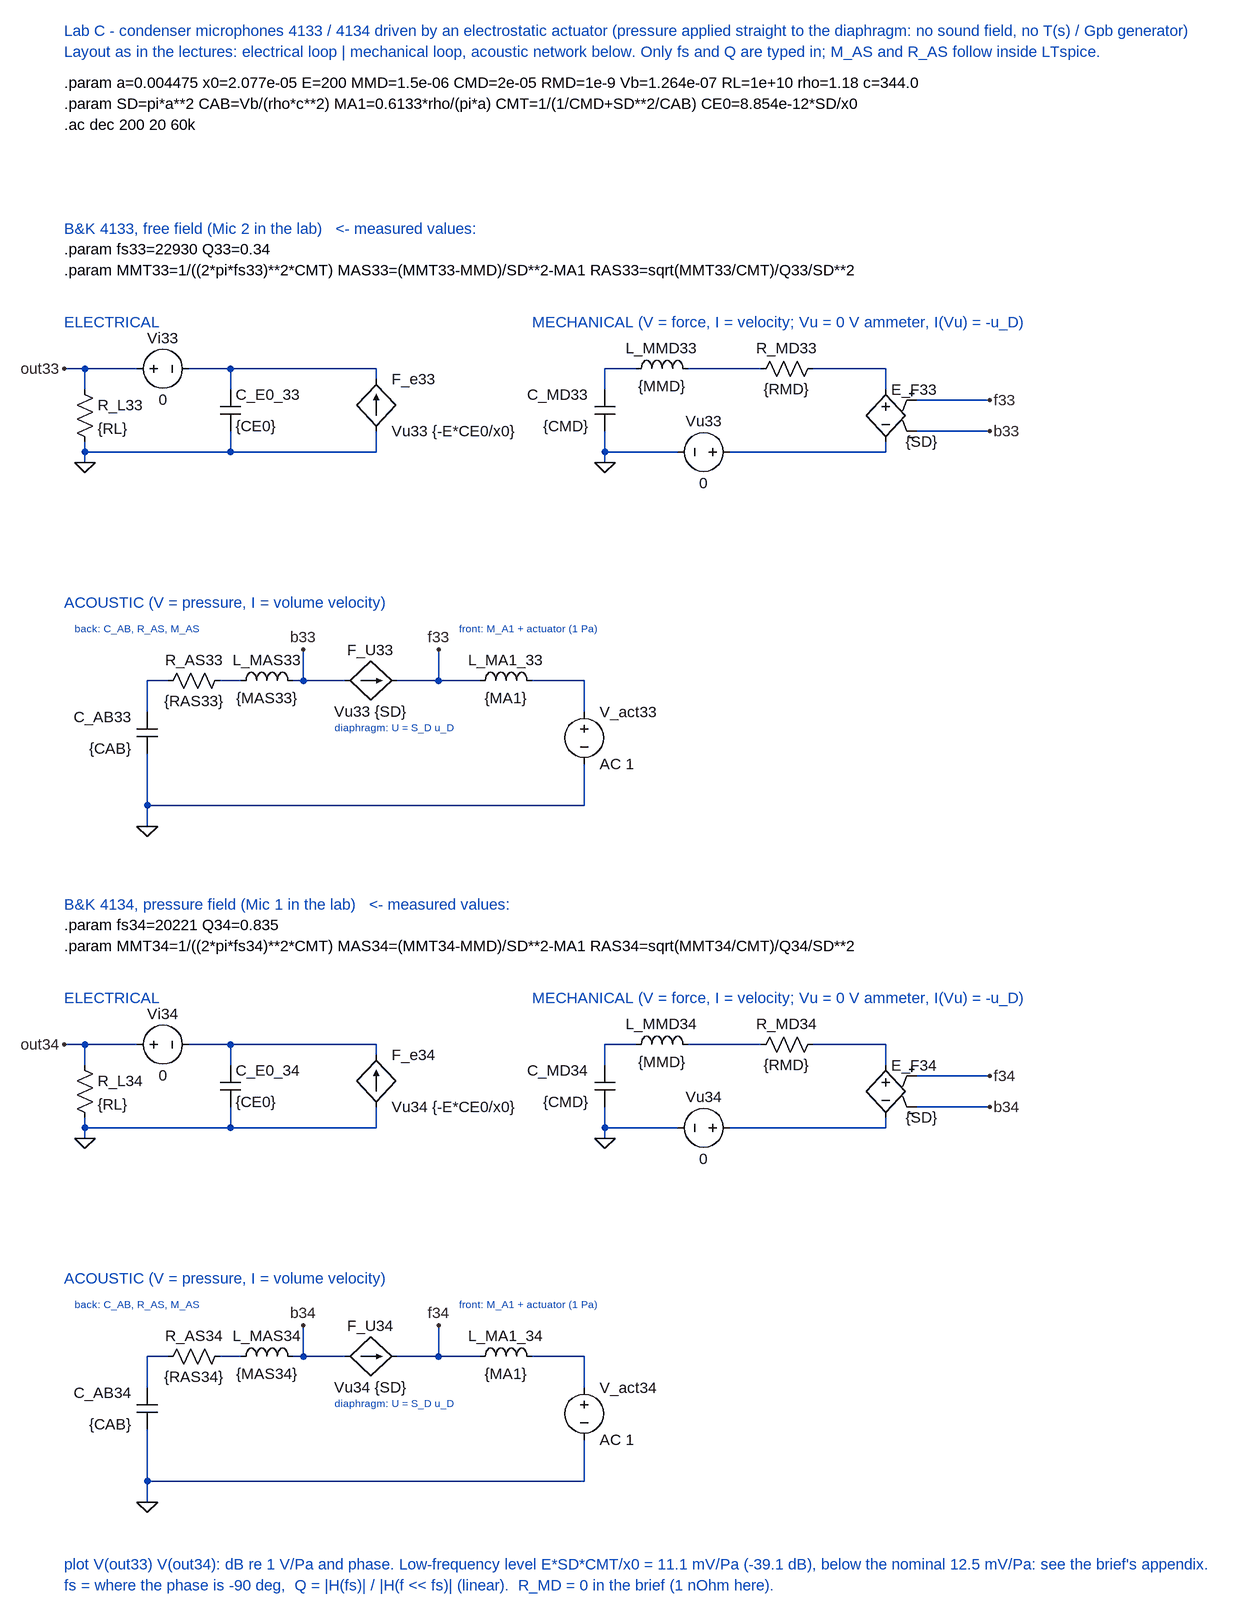
[diagram p0: schematic LabC_CondenserMics.asc]
LabC_CondenserMics.asc, the LTspice schematic file:
Version 4.1
SHEET 1 2400 2000
TEXT -128 -440 Left 2 ;Lab C - condenser microphones 4133 / 4134 driven by an electrostatic actuator (pressure applied straight to the diaphragm: no sound field, no T(s) / Gpb generator)
TEXT -128 -408 Left 2 ;Layout as in the lectures: electrical loop | mechanical loop, acoustic network below. Only fs and Q are typed in; M_AS and R_AS follow inside LTspice.
TEXT -128 -360 Left 2 !.param a=0.004475 x0=2.077e-05 E=200 MMD=1.5e-06 CMD=2e-05 RMD=1e-9 Vb=1.264e-07 RL=1e+10 rho=1.18 c=344.0
TEXT -128 -328 Left 2 !.param SD=pi*a**2 CAB=Vb/(rho*c**2) MA1=0.6133*rho/(pi*a) CMT=1/(1/CMD+SD**2/CAB) CE0=8.854e-12*SD/x0
TEXT -128 -296 Left 2 !.ac dec 200 20 60k
TEXT -128 -136 Left 2 ;B&K 4133, free field (Mic 2 in the lab)   <- measured values:
TEXT -128 -104 Left 2 !.param fs33=22930 Q33=0.34
TEXT -128 -72 Left 2 !.param MMT33=1/((2*pi*fs33)**2*CMT) MAS33=(MMT33-MMD)/SD**2-MA1 RAS33=sqrt(MMT33/CMT)/Q33/SD**2
TEXT -128 8 Left 2 ;ELECTRICAL
WIRE -96 80 -128 80
WIRE -16 80 -96 80
WIRE 128 80 64 80
WIRE 352 80 128 80
WIRE 352 96 352 80
WIRE -96 112 -96 80
WIRE 128 112 128 80
WIRE -96 208 -96 192
WIRE 128 208 128 176
WIRE 128 208 -96 208
WIRE 352 208 352 176
WIRE 352 208 128 208
WIRE -96 224 -96 208
FLAG -96 224 0
FLAG -128 80 out33
SYMBOL res -112 96 R0
SYMATTR InstName R_L33
SYMATTR Value {RL}
SYMBOL voltage -32 80 R270
WINDOW 0 32 56 VTop 2
WINDOW 3 -32 56 VBottom 2
SYMATTR InstName Vi33
SYMATTR Value 0
SYMBOL cap 112 112 R0
SYMATTR InstName C_E0_33
SYMATTR Value {CE0}
SYMBOL f 352 176 M180
WINDOW 0 24 80 Left 2
WINDOW 3 24 0 Left 2
SYMATTR InstName F_e33
SYMATTR Value Vu33 {-E*CE0/x0}
TEXT 592 8 Left 2 ;MECHANICAL (V = force, I = velocity; Vu = 0 V ammeter, I(Vu) = -u_D)
WIRE 752 80 704 80
WIRE 944 80 832 80
WIRE 1136 80 1024 80
WIRE 1136 112 1136 80
WIRE 704 112 704 80
WIRE 704 208 704 176
WIRE 816 208 704 208
WIRE 1136 208 1136 192
WIRE 1136 208 896 208
WIRE 704 224 704 208
WIRE 1184 128 1296 128
WIRE 1184 176 1296 176
FLAG 704 224 0
FLAG 1296 128 f33
FLAG 1296 176 b33
SYMBOL cap 688 112 R0
WINDOW 0 -8 8 Right 2
WINDOW 3 -8 56 Right 2
SYMATTR InstName C_MD33
SYMATTR Value {CMD}
SYMBOL ind 736 96 R270
WINDOW 0 32 56 VTop 2
WINDOW 3 5 56 VBottom 2
SYMATTR InstName L_MMD33
SYMATTR Value {MMD}
SYMATTR SpiceLine Rser=0
SYMBOL res 1040 64 R90
WINDOW 0 0 56 VBottom 2
WINDOW 3 32 56 VTop 2
SYMATTR InstName R_MD33
SYMATTR Value {RMD}
SYMBOL e 1136 96 M0
WINDOW 0 -80 16 Left 2
WINDOW 3 -80 96 Left 2
SYMATTR InstName E_F33
SYMATTR Value {SD}
SYMBOL voltage 912 208 R90
WINDOW 0 -32 56 VBottom 2
WINDOW 3 32 56 VTop 2
SYMATTR InstName Vu33
SYMATTR Value 0
TEXT -128 440 Left 2 ;ACOUSTIC (V = pressure, I = volume velocity)
TEXT -112 480 Left 1 ;back: C_AB, R_AS, M_AS
TEXT 288 632 Left 1 ;diaphragm: U = S_D u_D
TEXT 480 480 Left 1 ;front: M_A1 + actuator (1 Pa)
WIRE 32 560 0 560
WIRE 144 560 112 560
WIRE 288 560 224 560
WIRE 240 560 240 512
WIRE 304 560 288 560
WIRE 448 560 448 512
WIRE 400 560 384 560
WIRE 512 560 400 560
WIRE 672 560 592 560
WIRE 672 608 672 560
WIRE 0 608 0 560
WIRE 0 752 0 672
WIRE 672 752 672 688
WIRE 672 752 0 752
WIRE 0 784 0 752
FLAG 0 784 0
FLAG 448 512 f33
FLAG 240 512 b33
SYMBOL cap -16 608 R0
WINDOW 0 -8 8 Right 2
WINDOW 3 -8 56 Right 2
SYMATTR InstName C_AB33
SYMATTR Value {CAB}
SYMATTR SpiceLine Rpar=1e15
SYMBOL res 128 544 R90
WINDOW 0 0 56 VBottom 2
WINDOW 3 32 56 VTop 2
SYMATTR InstName R_AS33
SYMATTR Value {RAS33}
SYMBOL ind 128 576 R270
WINDOW 0 32 56 VTop 2
WINDOW 3 5 56 VBottom 2
SYMATTR InstName L_MAS33
SYMATTR Value {MAS33}
SYMATTR SpiceLine Rser=0
SYMBOL f 304 560 R270
WINDOW 0 32 40 VTop 2
WINDOW 3 -32 40 VBottom 2
SYMATTR InstName F_U33
SYMATTR Value Vu33 {SD}
SYMBOL ind 496 576 R270
WINDOW 0 32 56 VTop 2
WINDOW 3 5 56 VBottom 2
SYMATTR InstName L_MA1_33
SYMATTR Value {MA1}
SYMATTR SpiceLine Rser=0
SYMBOL voltage 672 592 R0
SYMATTR InstName V_act33
SYMATTR Value AC 1
TEXT -128 904 Left 2 ;B&K 4134, pressure field (Mic 1 in the lab)   <- measured values:
TEXT -128 936 Left 2 !.param fs34=20221 Q34=0.835
TEXT -128 968 Left 2 !.param MMT34=1/((2*pi*fs34)**2*CMT) MAS34=(MMT34-MMD)/SD**2-MA1 RAS34=sqrt(MMT34/CMT)/Q34/SD**2
TEXT -128 1048 Left 2 ;ELECTRICAL
WIRE -96 1120 -128 1120
WIRE -16 1120 -96 1120
WIRE 128 1120 64 1120
WIRE 352 1120 128 1120
WIRE 352 1136 352 1120
WIRE -96 1152 -96 1120
WIRE 128 1152 128 1120
WIRE -96 1248 -96 1232
WIRE 128 1248 128 1216
WIRE 128 1248 -96 1248
WIRE 352 1248 352 1216
WIRE 352 1248 128 1248
WIRE -96 1264 -96 1248
FLAG -96 1264 0
FLAG -128 1120 out34
SYMBOL res -112 1136 R0
SYMATTR InstName R_L34
SYMATTR Value {RL}
SYMBOL voltage -32 1120 R270
WINDOW 0 32 56 VTop 2
WINDOW 3 -32 56 VBottom 2
SYMATTR InstName Vi34
SYMATTR Value 0
SYMBOL cap 112 1152 R0
SYMATTR InstName C_E0_34
SYMATTR Value {CE0}
SYMBOL f 352 1216 M180
WINDOW 0 24 80 Left 2
WINDOW 3 24 0 Left 2
SYMATTR InstName F_e34
SYMATTR Value Vu34 {-E*CE0/x0}
TEXT 592 1048 Left 2 ;MECHANICAL (V = force, I = velocity; Vu = 0 V ammeter, I(Vu) = -u_D)
WIRE 752 1120 704 1120
WIRE 944 1120 832 1120
WIRE 1136 1120 1024 1120
WIRE 1136 1152 1136 1120
WIRE 704 1152 704 1120
WIRE 704 1248 704 1216
WIRE 816 1248 704 1248
WIRE 1136 1248 1136 1232
WIRE 1136 1248 896 1248
WIRE 704 1264 704 1248
WIRE 1184 1168 1296 1168
WIRE 1184 1216 1296 1216
FLAG 704 1264 0
FLAG 1296 1168 f34
FLAG 1296 1216 b34
SYMBOL cap 688 1152 R0
WINDOW 0 -8 8 Right 2
WINDOW 3 -8 56 Right 2
SYMATTR InstName C_MD34
SYMATTR Value {CMD}
SYMBOL ind 736 1136 R270
WINDOW 0 32 56 VTop 2
WINDOW 3 5 56 VBottom 2
SYMATTR InstName L_MMD34
SYMATTR Value {MMD}
SYMATTR SpiceLine Rser=0
SYMBOL res 1040 1104 R90
WINDOW 0 0 56 VBottom 2
WINDOW 3 32 56 VTop 2
SYMATTR InstName R_MD34
SYMATTR Value {RMD}
SYMBOL e 1136 1136 M0
WINDOW 0 -80 16 Left 2
WINDOW 3 -80 96 Left 2
SYMATTR InstName E_F34
SYMATTR Value {SD}
SYMBOL voltage 912 1248 R90
WINDOW 0 -32 56 VBottom 2
WINDOW 3 32 56 VTop 2
SYMATTR InstName Vu34
SYMATTR Value 0
TEXT -128 1480 Left 2 ;ACOUSTIC (V = pressure, I = volume velocity)
TEXT -112 1520 Left 1 ;back: C_AB, R_AS, M_AS
TEXT 288 1672 Left 1 ;diaphragm: U = S_D u_D
TEXT 480 1520 Left 1 ;front: M_A1 + actuator (1 Pa)
WIRE 32 1600 0 1600
WIRE 144 1600 112 1600
WIRE 288 1600 224 1600
WIRE 240 1600 240 1552
WIRE 304 1600 288 1600
WIRE 448 1600 448 1552
WIRE 400 1600 384 1600
WIRE 512 1600 400 1600
WIRE 672 1600 592 1600
WIRE 672 1648 672 1600
WIRE 0 1648 0 1600
WIRE 0 1792 0 1712
WIRE 672 1792 672 1728
WIRE 672 1792 0 1792
WIRE 0 1824 0 1792
FLAG 0 1824 0
FLAG 448 1552 f34
FLAG 240 1552 b34
SYMBOL cap -16 1648 R0
WINDOW 0 -8 8 Right 2
WINDOW 3 -8 56 Right 2
SYMATTR InstName C_AB34
SYMATTR Value {CAB}
SYMATTR SpiceLine Rpar=1e15
SYMBOL res 128 1584 R90
WINDOW 0 0 56 VBottom 2
WINDOW 3 32 56 VTop 2
SYMATTR InstName R_AS34
SYMATTR Value {RAS34}
SYMBOL ind 128 1616 R270
WINDOW 0 32 56 VTop 2
WINDOW 3 5 56 VBottom 2
SYMATTR InstName L_MAS34
SYMATTR Value {MAS34}
SYMATTR SpiceLine Rser=0
SYMBOL f 304 1600 R270
WINDOW 0 32 40 VTop 2
WINDOW 3 -32 40 VBottom 2
SYMATTR InstName F_U34
SYMATTR Value Vu34 {SD}
SYMBOL ind 496 1616 R270
WINDOW 0 32 56 VTop 2
WINDOW 3 5 56 VBottom 2
SYMATTR InstName L_MA1_34
SYMATTR Value {MA1}
SYMATTR SpiceLine Rser=0
SYMBOL voltage 672 1632 R0
SYMATTR InstName V_act34
SYMATTR Value AC 1
TEXT -128 1920 Left 2 ;plot V(out33) V(out34): dB re 1 V/Pa and phase. Low-frequency level E*SD*CMT/x0 = 11.1 mV/Pa (-39.1 dB), below the nominal 12.5 mV/Pa: see the brief's appendix.
TEXT -128 1952 Left 2 ;fs = where the phase is -90 deg,  Q = |H(fs)| / |H(f << fs)| (linear).  R_MD = 0 in the brief (1 nOhm here).

The netlist it stands for:
* LabC_CondenserMics.asc
R_L33 out33 0 {RL}
Vi33 out33 N001 0
C_E0_33 N001 0 {CE0}
F_e33 0 N001 Vu33 {-E*CE0/x0}
C_MD33 N002 0 {CMD}
L_MMD33 N002 N003 {MMD} Rser=0
R_MD33 N004 N003 {RMD}
E_F33 N004 N005 f33 b33 {SD}
Vu33 N005 0 0
C_AB33 N006 0 {CAB} Rpar=1e15
R_AS33 N007 N006 {RAS33}
L_MAS33 N007 b33 {MAS33} Rser=0
F_U33 b33 f33 Vu33 {SD}
L_MA1_33 f33 N008 {MA1} Rser=0
V_act33 N008 0 AC 1
R_L34 out34 0 {RL}
Vi34 out34 N009 0
C_E0_34 N009 0 {CE0}
F_e34 0 N009 Vu34 {-E*CE0/x0}
C_MD34 N010 0 {CMD}
L_MMD34 N010 N011 {MMD} Rser=0
R_MD34 N012 N011 {RMD}
E_F34 N012 N013 f34 b34 {SD}
Vu34 N013 0 0
C_AB34 N014 0 {CAB} Rpar=1e15
R_AS34 N015 N014 {RAS34}
L_MAS34 N015 b34 {MAS34} Rser=0
F_U34 b34 f34 Vu34 {SD}
L_MA1_34 f34 N016 {MA1} Rser=0
V_act34 N016 0 AC 1
* Lab C - condenser microphones 4133 / 4134 driven by an electrostatic actuator (pressure applied straight to the diaphragm: no sound field, no T(s) / Gpb generator)
* Layout as in the lectures: electrical loop | mechanical loop, acoustic network below. Only fs and Q are typed in; M_AS and R_AS follow inside LTspice.
.param a=0.004475 x0=2.077e-05 E=200 MMD=1.5e-06 CMD=2e-05 RMD=1e-9 Vb=1.264e-07 RL=1e+10 rho=1.18 c=344.0
.param SD=pi*a**2 CAB=Vb/(rho*c**2) MA1=0.6133*rho/(pi*a) CMT=1/(1/CMD+SD**2/CAB) CE0=8.854e-12*SD/x0
.ac dec 200 20 60k
* B&K 4133, free field (Mic 2 in the lab)   <- measured values:
.param fs33=22930 Q33=0.34
.param MMT33=1/((2*pi*fs33)**2*CMT) MAS33=(MMT33-MMD)/SD**2-MA1 RAS33=sqrt(MMT33/CMT)/Q33/SD**2
* ELECTRICAL
* MECHANICAL (V = force, I = velocity; Vu = 0 V ammeter, I(Vu) = -u_D)
* ACOUSTIC (V = pressure, I = volume velocity)
* back: C_AB, R_AS, M_AS
* diaphragm: U = S_D u_D
* front: M_A1 + actuator (1 Pa)
* B&K 4134, pressure field (Mic 1 in the lab)   <- measured values:
.param fs34=20221 Q34=0.835
.param MMT34=1/((2*pi*fs34)**2*CMT) MAS34=(MMT34-MMD)/SD**2-MA1 RAS34=sqrt(MMT34/CMT)/Q34/SD**2
* ELECTRICAL
* MECHANICAL (V = force, I = velocity; Vu = 0 V ammeter, I(Vu) = -u_D)
* ACOUSTIC (V = pressure, I = volume velocity)
* back: C_AB, R_AS, M_AS
* diaphragm: U = S_D u_D
* front: M_A1 + actuator (1 Pa)
* plot V(out33) V(out34): dB re 1 V/Pa and phase. Low-frequency level E*SD*CMT/x0 = 11.1 mV/Pa (-39.1 dB), below the nominal 12.5 mV/Pa: see the brief's appendix.
* fs = where the phase is -90 deg,  Q = |H(fs)| / |H(f << fs)| (linear).  R_MD = 0 in the brief (1 nOhm here).
.backanno
.end